# EAGLE design SRF Light Switch (EAGLE 7.2.0)
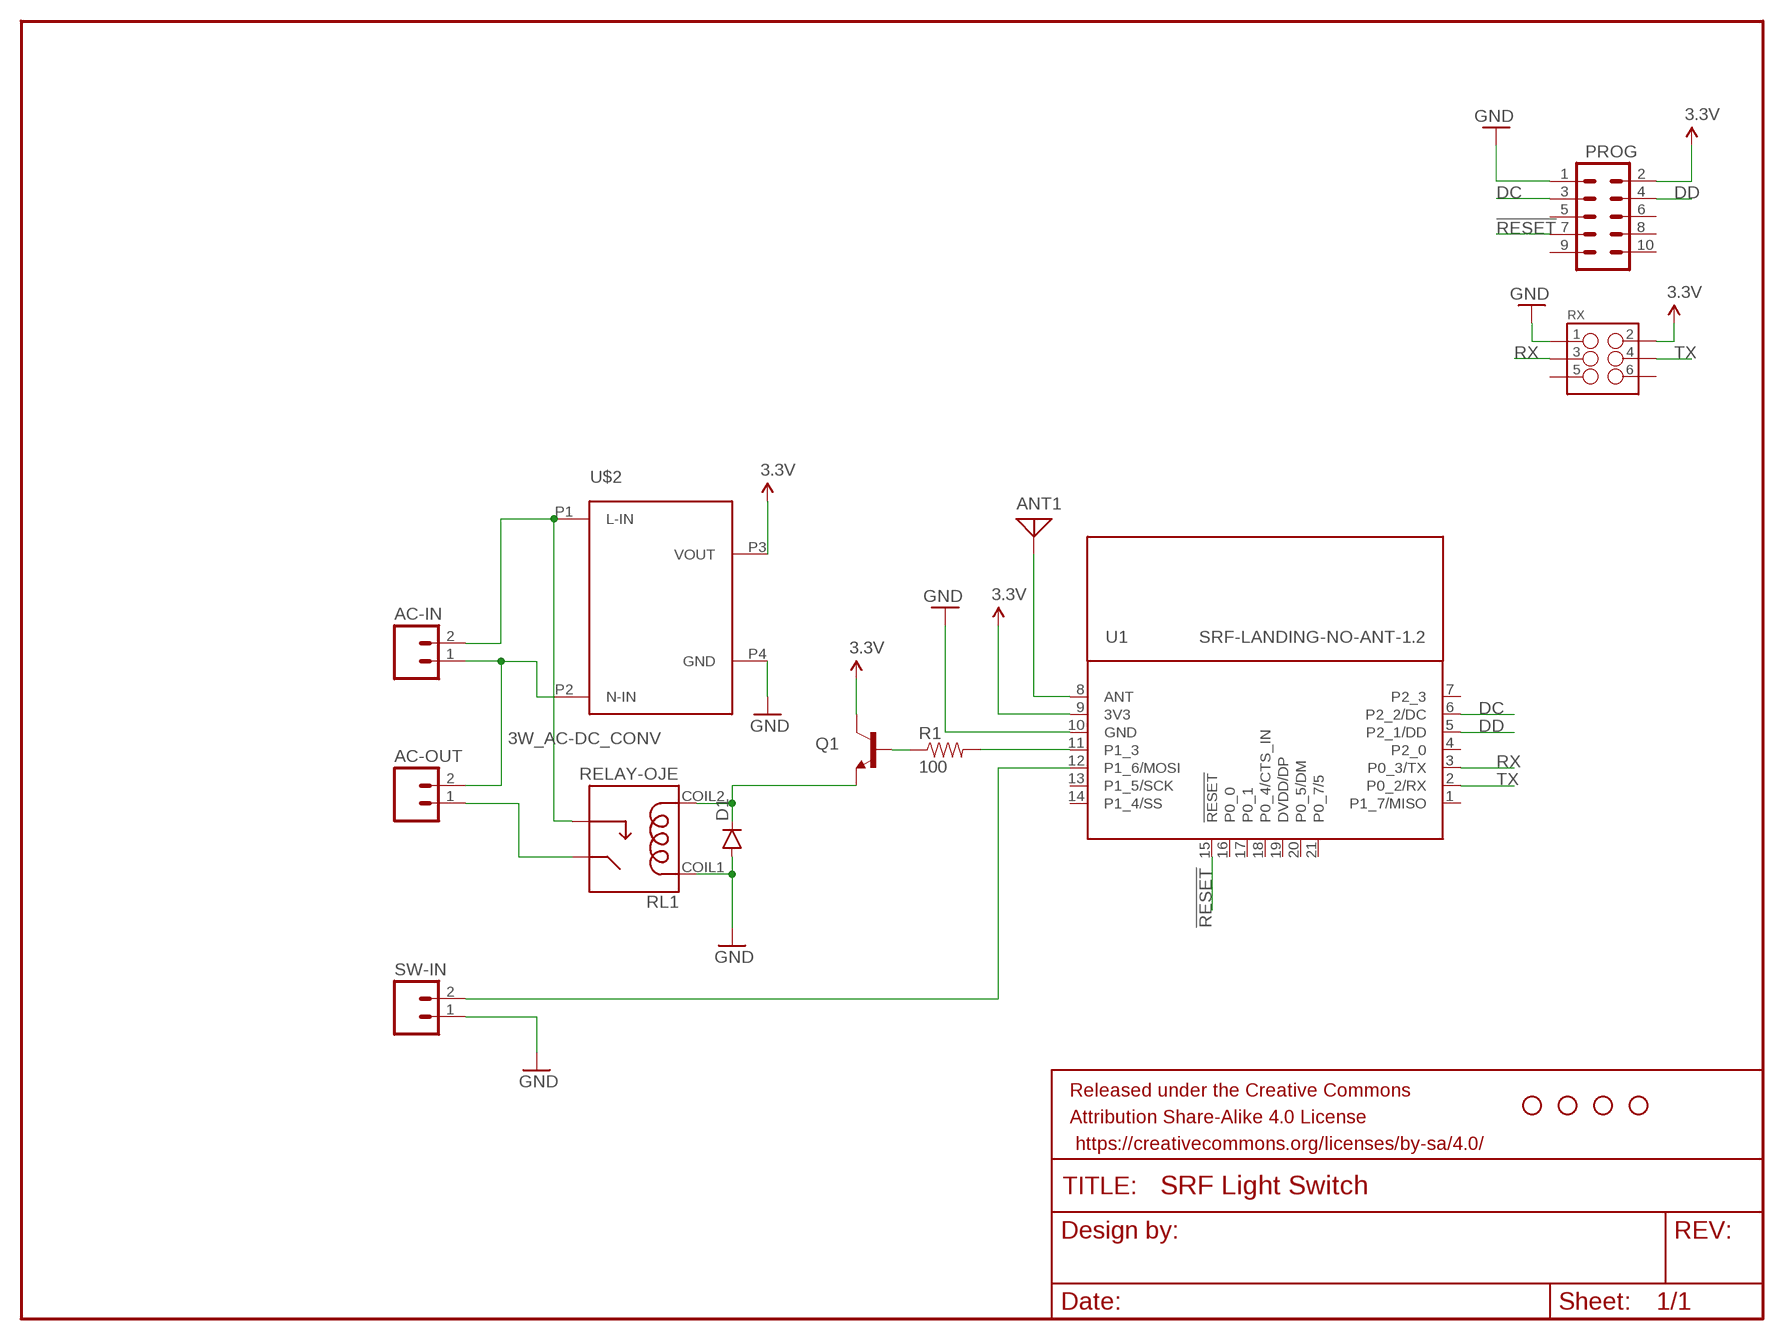
[diagram p0: schematic, sheet 1]

## Parts
AC-IN  M025MM  [SCREWTERMINAL-5MM-2]
AC-OUT  M025MM  [SCREWTERMINAL-5MM-2]
ANT1  ANTENNA  [PAD-01]
D1  DIODEPTH  [DIODE-1N4001]
FRAME1  FRAME-LETTER  [CREATIVE_COMMONS]
PROG  M05X2SHD  [2X5-SHROUDED]
Q1  TRANSISTOR_NPNTO92  [TO-92]
R1  100  RESISTORPTH-1/4W  [AXIAL-0.4]
RL1  RELAY-OJE  [RELAY-OJE]
RX  M03X2SHROUD  [2X3-SHROUDED]
STANDOFF1  STAND-OFF  [STAND-OFF]
STANDOFF2  STAND-OFF  [STAND-OFF]
STANDOFF3  STAND-OFF  [STAND-OFF]
STANDOFF4  STAND-OFF  [STAND-OFF]
SW-IN  M025MM  [SCREWTERMINAL-5MM-2]
U1  SRF-LANDING-NO-ANT-1.2  [SRF-LANDING-NO-ANT-1.2]
U$2  3W_AC-DC_CONV  [3W_AC-DC_CONV]

## Nets
3.3V: PROG.2 Q1.3(C) RX.2 U1.9(3V3) U$2.P3(VOUT)
!RESET: PROG.7 U1.15(!RESET)
ANT [ANT]: ANT1.1 U1.8(ANT)
DC: PROG.3 U1.6(P2_2/DC)
DD: PROG.4 U1.5(P2_1/DD)
GND: D1.A PROG.1 RL1.COIL1 RX.1 SW-IN.1 U1.10(GND) U$2.P4(GND)
N$1: D1.C Q1.1(E) RL1.COIL2
N$2: AC-IN.2 RL1.NO U$2.P1(L-IN)
N$3: SW-IN.2 U1.12(P1_6/MOSI)
N$4: Q1.2(B) R1.P$1
N$6: R1.P$2 U1.11(P1_3)
N$7: AC-IN.1 AC-OUT.2 U$2.P2(N-IN)
N$12: AC-OUT.1 RL1.COM
RX: RX.3 U1.3(P0_3/TX)
TX: RX.4 U1.2(P0_2/RX)
Unconnected: PROG.5 PROG.6 PROG.8 PROG.9 PROG.10 RX.5 RX.6 U1.1(P1_7/MISO) U1.4(P2_0) U1.7(P2_3) U1.13(P1_5/SCK) U1.14(P1_4/SS) U1.16(P0_0) U1.17(P0_1) U1.18(P0_4/CTS_IN) U1.19(DVDD/DP) U1.20(P0_5/DM) U1.21(P0_7/5)

## Library data of the parts
AC-IN AC-OUT SW-IN = SparkFun-Connectors:M02: Standard 2-pin 0.1" header. Use with - straight break away headers ( PRT-00116) - right angle break away headers (PRT-00553) - swiss pins (PRT-00743) - machine pins (PRT-00117) - female headers (PRT-00115) Molex polarized connector foot print use with: PRT-08233 with associated crimp pins and housings. 2.54_SCREWTERM for use with PRT-10571. 3.5mm Screw Terminal footprints for PRT-08084 5mm Screw Terminal footprints for use with PRT-08432; STOREFRONT_ID: PRT-08432
ANT1 = discrete:ANTENNA: Antenna
D1 = SparkFun-DiscreteSemi:DIODE: Diode These are standard reverse protection diodes and small signal diodes. SMA package can handle up to about 1A. SOD-323 can handle about 200mA. What the SOD-323 package when ordering, there are some mfgs out there that are 5-pin packages.
FRAME1 = SparkFun-Aesthetics:FRAME-LETTER: Schematic Frame Standard 8.5x11 US Letter frame; DESIGNER: NAME; VERSION: v01
PROG = SparkFun-Connectors:M05X2: Header 5x2 Standard 10-pin dual row 0.1" header. Commonly used with AVR-ISP. Use with Spark Fun Electronics SKU: PRT-00778
Q1 = SparkFun-DiscreteSemi:TRANSISTOR_NPN: Generic NPN BJT MMBT2222A - TRANS-08049 (SOT-23, 1A 40V) MPSA42 - TRANS-09116 (SOT-23, 500mA 300V) MMBT5088LT1G - TRANS-11160 (SOT-23, 50 mA 30V) BC547 - COM-08928 <http://www.sparkfun.com/products/8928> (TO-92 45V 100mA) (1.Collector 2.Base 3.Emitter) 2N3904 - COM-00521 <http://www.sparkfun.com/products/521> (TO-92 40V 200mA) (1.Emitter 2.Base 3.Collector) P2N2222A - COM-12852 <http://www.sparkfun.com/products/12852> (TO-92 40V 600mA) (1.Collector 2.Base 3.Emitter)
R1 = SparkFun-Passives:RESISTOR: Resistor Basic schematic elements and footprints for 0603, 1206, and PTH resistors.
RL1 = SparkFun-Electromechanical:RELAY-OJE: TE Connectivity OJE Minature PCB Relay
RX = SparkFun-Connectors:M03X2: 2x3 .1" header. Shrouded, with keying- CONN-10681 SMT- CONN-11415 Pogo pins- HW-11044; PROD_ID: CONN-10681
STANDOFF1-STANDOFF4 = SparkFun-Electromechanical:STAND-OFF: #4 Stand Off This is the mechanical footprint for a #4 phillips button head screw. Use the keepout ring to avoid running the screw head into surrounding components. SKU : PRT-00447
U1 = Ciseco Footprints:SRF: SRF Wireless UART Serial Data Module. www.ciseco.co.uk
U$2 = SparkFun-PowerIC:3W_AC-DC_CONV: Vigortronix 3W AC-DC Converter. Parts: VTX-214-003-(103 - 148)

## Net classes
1 ANT: width 1.27 mm, clearance 0.45 mm

## Board
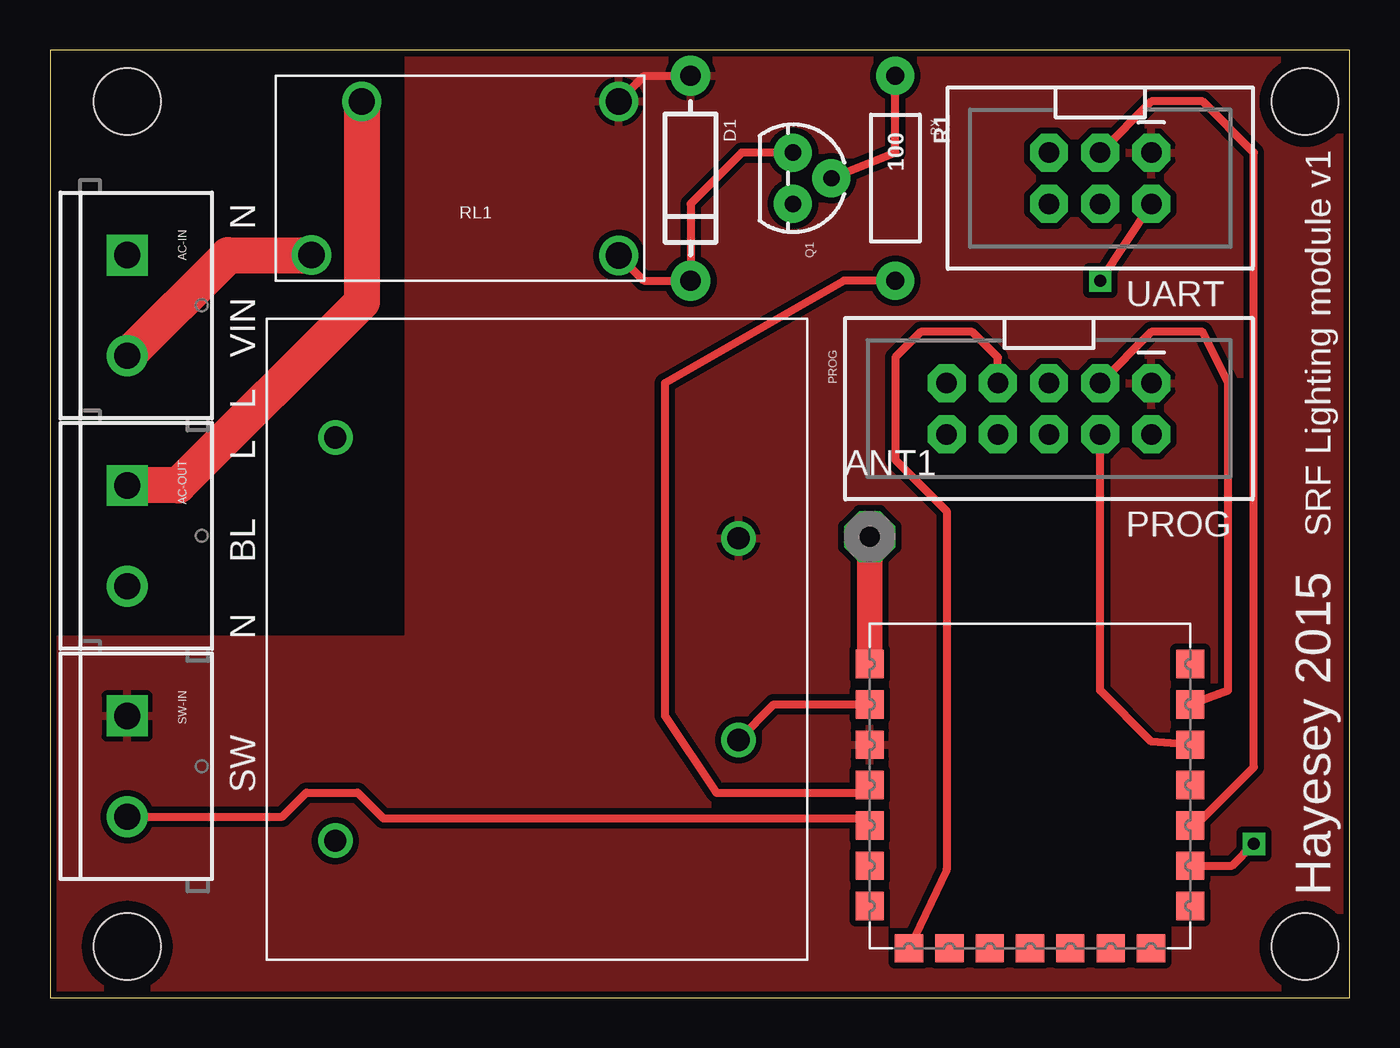
[diagram p1: board, top side]
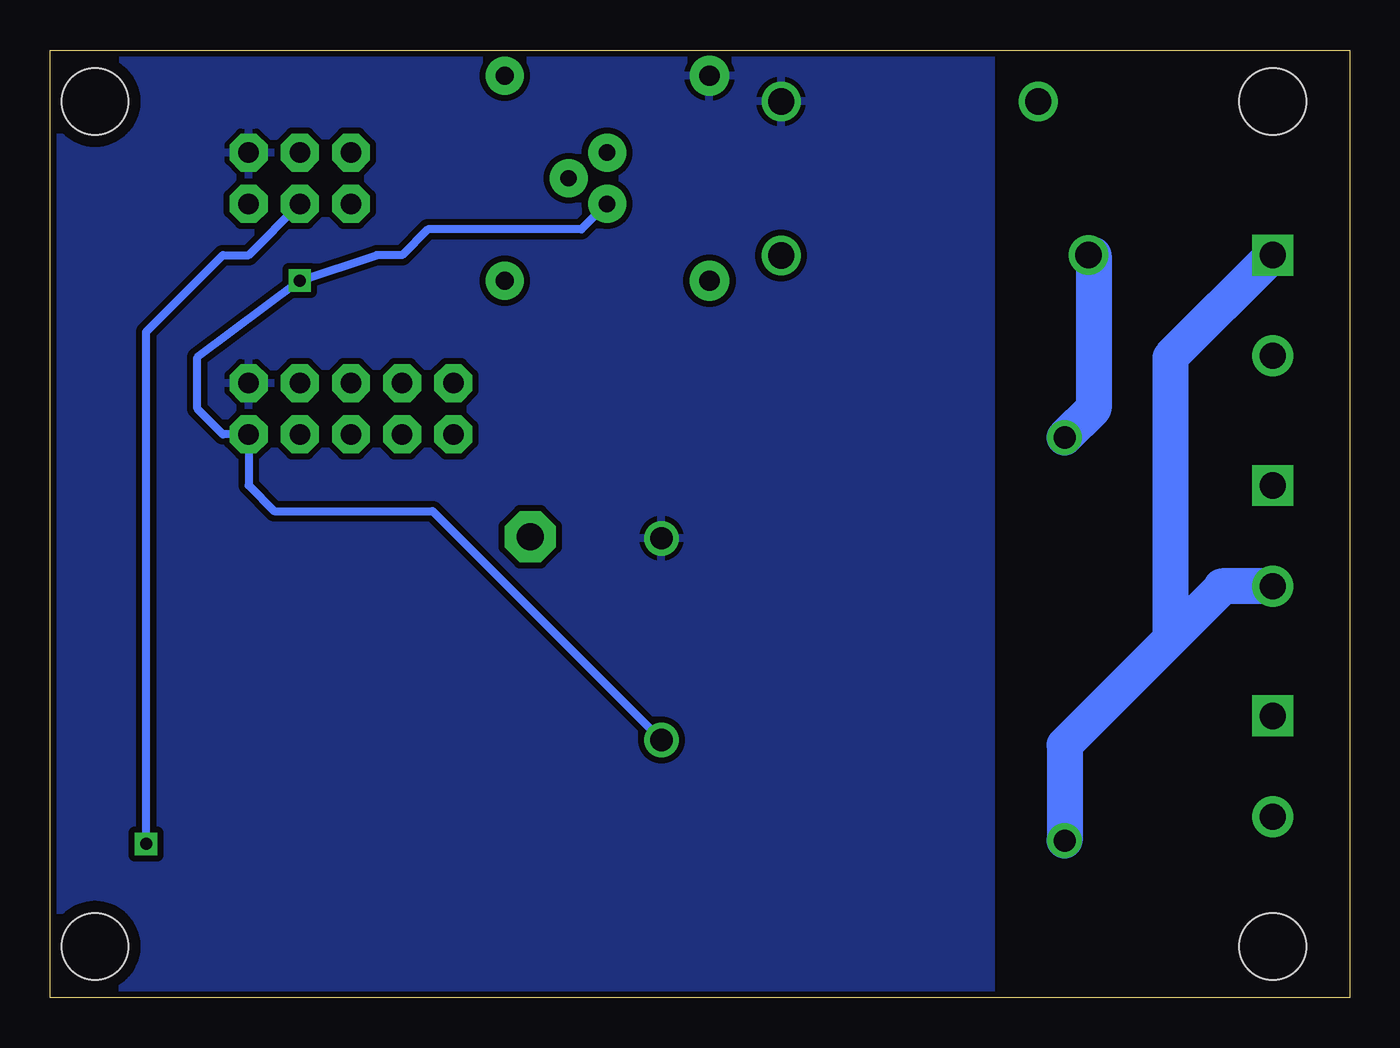
[diagram p2: board, bottom side, seen from below]

Size 64.44 x 46.98 mm. Coordinates in mm from the lower left corner, seen from the top.
Outline: 0,0 64.44,0 64.44,46.98 0,46.98 0,0
Copper layers (1*16): Top 0.035mm / dielectric 1.5mm / Bottom 0.035mm
Design rules "SparkFun": minimum track width 8mil, minimum drill 20mil, track to track 8mil, track to pad 8mil, pad to pad 8mil, via to via 8mil, smd to smd 8mil, copper to edge 8mil, drill to drill 8mil, minimum pad ring 12mil, minimum via ring 10mil, stop-mask expansion 4mil, vias tented up to drill 20mil, thermal gap 10mil

### Footprints (pad centres in the part's own frame; a part is rotated, then mirrored left to right if it is on the bottom)
SCREWTERMINAL-5MM-2 = drill 1.3 pad 2.032 square: 1 0,0 | drill 1.3 pad 2.032: 2 5,0
PAD-01 = drill 1.321 pad 2.54 octagon: 1 0,0
DIODE-1N4001 = drill 1 pad 1.981: A -5.08,0; C 5.08,0
2X5-SHROUDED = drill 1.016 pad 1.88 octagon: 1 -1.27,5.08; 2 1.27,5.08; 3 -1.27,2.54; 4 1.27,2.54; 5 -1.27,0; 6 1.27,0; 7 -1.27,-2.54; 8 1.27,-2.54; 9 -1.27,-5.08; 10 1.27,-5.08
TO-92 = drill 0.813 pad 1.88: 1 -1.27,0; 2 0,1.905; 3 1.27,0
AXIAL-0.4 = drill 0.9 pad 1.88: P$1 -5.08,0; P$2 5.08,0
RELAY-OJE = drill 1.3: COIL1 7.874,3.81; COIL2 7.874,-3.835; COM -4.877,3.81; NO -7.366,-3.81
2X3-SHROUDED = drill 1.016 pad 1.88 octagon: 1 -1.27,2.54; 2 1.27,2.54; 3 -1.27,0; 4 1.27,0; 5 -1.27,-2.54; 6 1.27,-2.54
STAND-OFF = hole 3.302: 0,0
SRF-LANDING-NO-ANT-1.2 = smd 1.4 x 1.4: 1 15.9,2; 2 15.9,4; 3 15.9,6; 4 15.9,8; 5 15.9,10; 6 15.9,12; 7 15.9,14; 8 0,14; 9 0,12; 10 0,10; 11 0,8; 12 0,6; 13 0,4; 14 0,2; 15 1.95,-0.1; 16 3.95,-0.1; 17 5.95,-0.1; 18 7.95,-0.1; 19 9.95,-0.1; 20 11.95,-0.1; 21 13.95,-0.1
3W_AC-DC_CONV = drill 1.1: P1 -10,-10; P2 10,-10; P3 5,10; P4 -5,10

### Placement (x,y rotation side)
AC-IN  3.81,36.83 270 top
AC-OUT  3.81,25.4 270 top
ANT1  40.64,22.86 0 top
D1  31.75,40.64 270 top
FRAME1  3.81,-12.7 0 top  (outside the outline)
PROG  49.53,29.21 270 top
Q1  36.83,40.64 270 top
R1  41.91,40.64 270 top
RL1  20.32,40.64 0 top
RX  52.07,40.64 270 top
STANDOFF1  3.81,44.45 0 top
STANDOFF2  62.23,44.45 0 top
STANDOFF3  3.81,2.54 0 top
STANDOFF4  62.23,2.54 0 top
SW-IN  3.81,13.97 270 top
U1  40.64,2.54 0 top
U$2  24.13,17.78 270 top

### Tracks (layer width: path | path; a pad name or v marks a point on that pad's centre or on a via)
3.3V  (via drill 0.6)
  Top 0.406: U$2.P3 35.89,14.54 U1.9 | RX.2 v52.07,35.56
  Bottom 0.406: Q1.3 38.1,38.1 45.72,38.1 46.99,36.83 48.26,36.83 v52.07,35.56 57.15,31.75 57.15,29.21 55.88,27.94 PROG.2 54.61,25.4 53.34,24.13 45.48,24.13 U$2.P3
!RESET
  Top 0.406: PROG.7 46.99,31.75 45.72,33.02 43.18,33.02 41.91,31.75 41.91,26.67 44.45,24.13 44.45,6.35 U1.15
ANT
  Top 1.27: U1.8 ANT1.1
DC
  Top 0.406: U1.6 58.42,15.24 58.42,30.48 57.15,33.02 54.61,33.02 PROG.3
DD
  Top 0.406: U1.5 54.61,12.7 52.07,15.24 PROG.4
GND
  Top 0.406: RL1.COIL1 29.46,45.72 D1.A
  pour Bottom (isolate 0.305): 17.78,46.99 64.77,46.99 64.77,0 17.78,0
  pour Top (isolate 0.305): 17.78,46.99 64.77,46.99 64.77,0 17.78,0
  pour Top (isolate 0.305): 0,17.78 17.78,17.78 17.78,0 0,0
N$1
  Top 0.406: RL1.COIL2 29.44,35.56 D1.C 31.75,39.37 34.29,41.91 Q1.1
N$2
  Top 1.778: AC-IN.2 8.81,36.83 RL1.NO
  Bottom 0.406: RL1.NO 12.7,36.83
  Bottom 1.778: 12.7,36.83 12.7,29.21 U$2.P1
N$3
  Top 0.406: SW-IN.2 11.51,8.97 12.7,10.16 15.24,10.16 16.51,8.89 40.29,8.89 U1.12
N$4
  Top 0.406: Q1.2 41.91,41.91 R1.P$1
N$6
  Top 0: U1.11 40.64,10.16
  Top 0.406: R1.P$2 39.37,35.56 30.48,30.48 30.48,13.97 33.02,10.16 40.64,10.16
N$7
  Bottom 0.406: 6.35,20.4 6.35,20.32
  Bottom 1.778: AC-OUT.2 6.35,20.4 | 6.35,20.32 8.89,17.78 | 8.89,17.78 14.13,12.54 U$2.P2 | AC-IN.1 8.89,31.75 8.89,17.78
N$12
  Top 1.778: RL1.COM 15.44,34.49 6.35,25.4 AC-OUT.1
RX
  Top 0.406: U1.3 56.8,8.54 59.69,11.43 59.69,41.91 57.15,44.45 54.61,44.45 RX.3
TX  (via drill 0.6)
  Top 0.406: U1.2 58.61,6.54 v59.69,7.62
  Bottom 0.406: v59.69,7.62 59.69,33.02 55.88,36.83 54.61,36.83 RX.4

### Text on the board
tPlace: N | UART | VIN | L | L | PROG | SRF Lighting module v1 | BL | N | SW | Hayesey 2015